# Altium schematic sheet segments.SchDoc: DE:TMP:11:UC:EXPANDIDO
size 248 x 127 mm; Date: 21-07-2022; SheetNumber: 1; SheetTotal: 1; WebFGR: www.abebashop.com; VersionFGR: 20220721; PageSetup: Record=PageOptions|CenterHorizontal=True|CenterVertical=True|PrintScale=0.94|XCorrection=1.00|YCorrection=1.00|PrintKind=0|BorderSize=5000000|LeftOffset=0|BottomOffset=0|Orientation=2|PaperLength=1000|PaperWidth=1000|Scale=100|PaperSource=7|PrintQuality=-4|MediaType=1|DitherType=10|PaperKind=Letter|PrintScaleMode=1
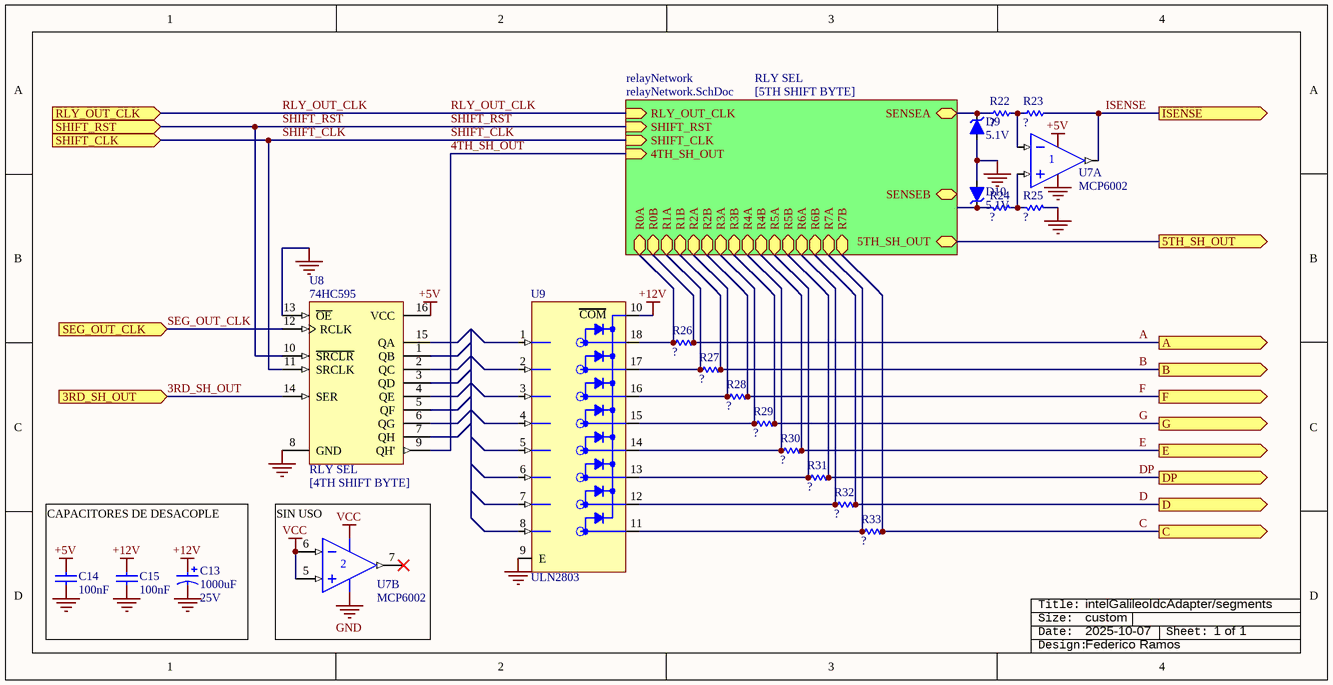
[diagram p0: segments.SchDoc]

## Parts
C13  value 1000uF  Voltaje: 25V  [C_EL_6-3X11]  (hidden comment: Cap Pol)
C14  value 100nF  [c1206]  (hidden comment: Cap)
C15  value 100nF  [c1206]  (hidden comment: Cap)
D9  VOLTAJE: 5.1V  [D_SOD27]  (hidden comment: Zener)
D10  VOLTAJE: 5.1V  [D_SOD27]  (hidden comment: Zener)
R22  Res  [R1206]  (value not drawn)
R23  Res  [R1206]  (value not drawn)
R24  Res  [R1206]  (value not drawn)
R25  Res  [R1206]  (value not drawn)
R26  Res  [R1206]  (value not drawn)
R27  Res  [R1206]  (value not drawn)
R28  Res  [R1206]  (value not drawn)
R29  Res  [R1206]  (value not drawn)
R30  Res  [R1206]  (value not drawn)
R31  Res  [R1206]  (value not drawn)
R32  Res  [R1206]  (value not drawn)
R33  Res  [R1206]  (value not drawn)
ROT?  Rotulo_empty  (value not drawn)  (graphical)
U7  MCP6002  [dip8z]  (parts A,B of 2)
U8  74HC595  [DIP16]
U9  ULN2803  [DIP18Z]

## Sub-sheets
relayNetwork = relayNetwork.SchDoc: R0A, R0B, R1A, R1B, R2A, R2B, R3A, R3B, R4A, R4B, R5A, R5B, R6A, R6B, R7A, R7B, SENSEB, SENSEA, RLY_OUT_CLK (in), SHIFT_RST (in), SHIFT_CLK (in), 4TH_SH_OUT (in), 5TH_SH_OUT  | : [5TH SHIFT BYTE]; : RLY SEL

## Ports
3RD_SH_OUT (in), 5TH_SH_OUT (out), A (out), B (out), C (out), D (out), DP (out), E (out), F (out), G (out), ISENSE (out), RLY_OUT_CLK (in), SEG_OUT_CLK (in), SHIFT_CLK (in), SHIFT_RST (in)

## Nets
+5V: C14.2 U7.8(V+) U8.16(VCC)
+12V: C13.1 C15.2 U9.10(~{COM})
GND: C13.2 C14.1 C15.1 D9.1(A) D10.1(A) R25.1 U7.4(V-) U8.8(GND) U8.13(~{OE}) U9.9(E)
VCC: U7.5(IN+) U7.6(IN-) U7.8(V+)
3RD_SH_OUT: U8.14(SER) ; port 3RD_SH_OUT
4TH_SH_OUT: U8.9(QH') ; sheet relayNetwork/4TH_SH_OUT
5TH_SH_OUT: port 5TH_SH_OUT, sheet relayNetwork/5TH_SH_OUT
A: R26.1 ; port A, sheet relayNetwork/R0B
B: R27.1 ; port B, sheet relayNetwork/R1B
C: R33.1 ; port C, sheet relayNetwork/R7B
D: R32.1 ; port D, sheet relayNetwork/R6B
DP: R31.1 ; port DP, sheet relayNetwork/R5B
E: R30.1 ; port E, sheet relayNetwork/R4B
F: R28.1 ; port F, sheet relayNetwork/R2B
G: R29.1 ; port G, sheet relayNetwork/R3B
ISENSE: R23.1 U7.1(OUT) ; port ISENSE
RLY_OUT_CLK: port RLY_OUT_CLK, sheet relayNetwork/RLY_OUT_CLK
SEG_OUT_CLK: U8.12(RCLK) ; port SEG_OUT_CLK
SHIFT_CLK: U8.11(SRCLK) ; port SHIFT_CLK, sheet relayNetwork/SHIFT_CLK
SHIFT_RST: U8.10(~{SRCLR}) ; port SHIFT_RST, sheet relayNetwork/SHIFT_RST
NetD9_2: D9.2(K) R22.2 ; sheet relayNetwork/SENSEA
NetD10_2: D10.2(K) R24.2
NetR22_1: R22.1 R23.2 U7.2(IN-)
NetR24_1: R24.1 R25.2 U7.3(IN+)
NetR26_2: R26.2 U9.18(~{C}1) ; sheet relayNetwork/R0A
NetR27_2: R27.2 U9.17(~{C}2) ; sheet relayNetwork/R1A
NetR28_2: R28.2 U9.16(~{C}3) ; sheet relayNetwork/R2A
NetR29_2: R29.2 U9.15(~{C}4) ; sheet relayNetwork/R3A
NetR30_2: R30.2 U9.14(~{C}5) ; sheet relayNetwork/R4A
NetR31_2: R31.2 U9.13(~{C}6) ; sheet relayNetwork/R5A
NetR32_2: R32.2 U9.12(~{C}7) ; sheet relayNetwork/R6A
NetR33_2: R33.2 U9.11(~{C}8) ; sheet relayNetwork/R7A

Not connected (* = marked no-connect by the designer): U7 7(OUT)*; U8 1(QB) 2(QC) 3(QD) 4(QE) 5(QF) 6(QG) 7(QH) 15(QA); U9 1(B1) 2(B2) 3(B3) 4(B4) 5(B5) 6(B6) 7(B7) 8(B8)

## Notes on the sheet
- CAPACITORES DE DESACOPLE
- (near U7) SIN USO
- (near ROT?) intelGalileoIdcAdapter/segments
- custom
- 2025-10-07
- (near ROT?) 1 of 1
- Federico Ramos
- (in symbol 74HC595) RLY SEL; [4TH SHIFT BYTE]
- (in symbol Rotulo_empty) Title:; Size:; Date:; Sheet:; Design:
- (in symbol ULN2803) COM

## Library data of the parts
C13 = Cap Pol: Capacitor Electrolítico; Price: ?
C14 C15 = Cap: Capacitor; Voltage: 50V; Price: 0.25; Technology: Ceramic
D9 D10 = Zener: Zener Diode; Price: ?
R22-R33 = Res: Resistencia; Power: 0.25W; Price: 0.036; Value: ?
ROT? = Rotulo_empty: Rotulo [consolas]
U7 = MCP6002: 1 MHz Bandwidth Low Power Op Amp
U8 = 74HC595: 8-Bit Shift Register with 3-State Output Registers
U9 = ULN2803: Darlington Transistor Array; Price: 1.40